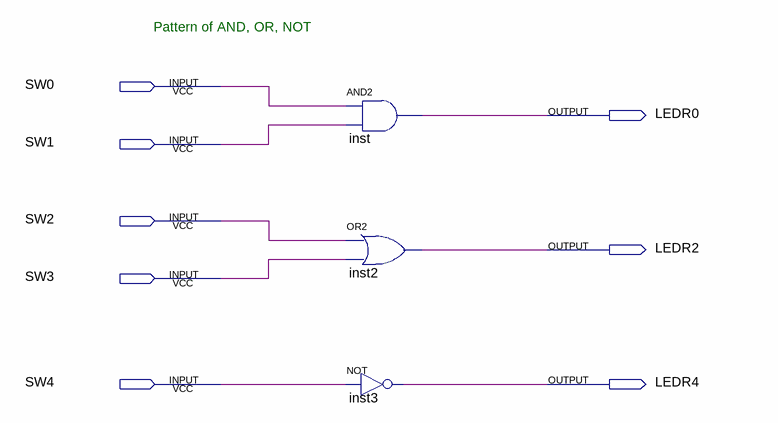
[diagram p0: schematic sheet]
// Quartus schematic multi.bdf as structural Verilog: 3 symbols, 8 pins
module multi (
  input  SW0,
  input  SW1,
  input  SW2,
  input  SW3,
  input  SW4,
  output LEDR0,
  output LEDR2,
  output LEDR4
);

  and inst (LEDR0, SW0, SW1);
  or inst2 (LEDR2, SW2, SW3);
  not inst3 (LEDR4, SW4);

  // Notes on the sheet:
  //   Pattern of AND, OR, NOT
endmodule
